# EAGLE design kombee (EAGLE 6.4)
www.komby.com/RF1
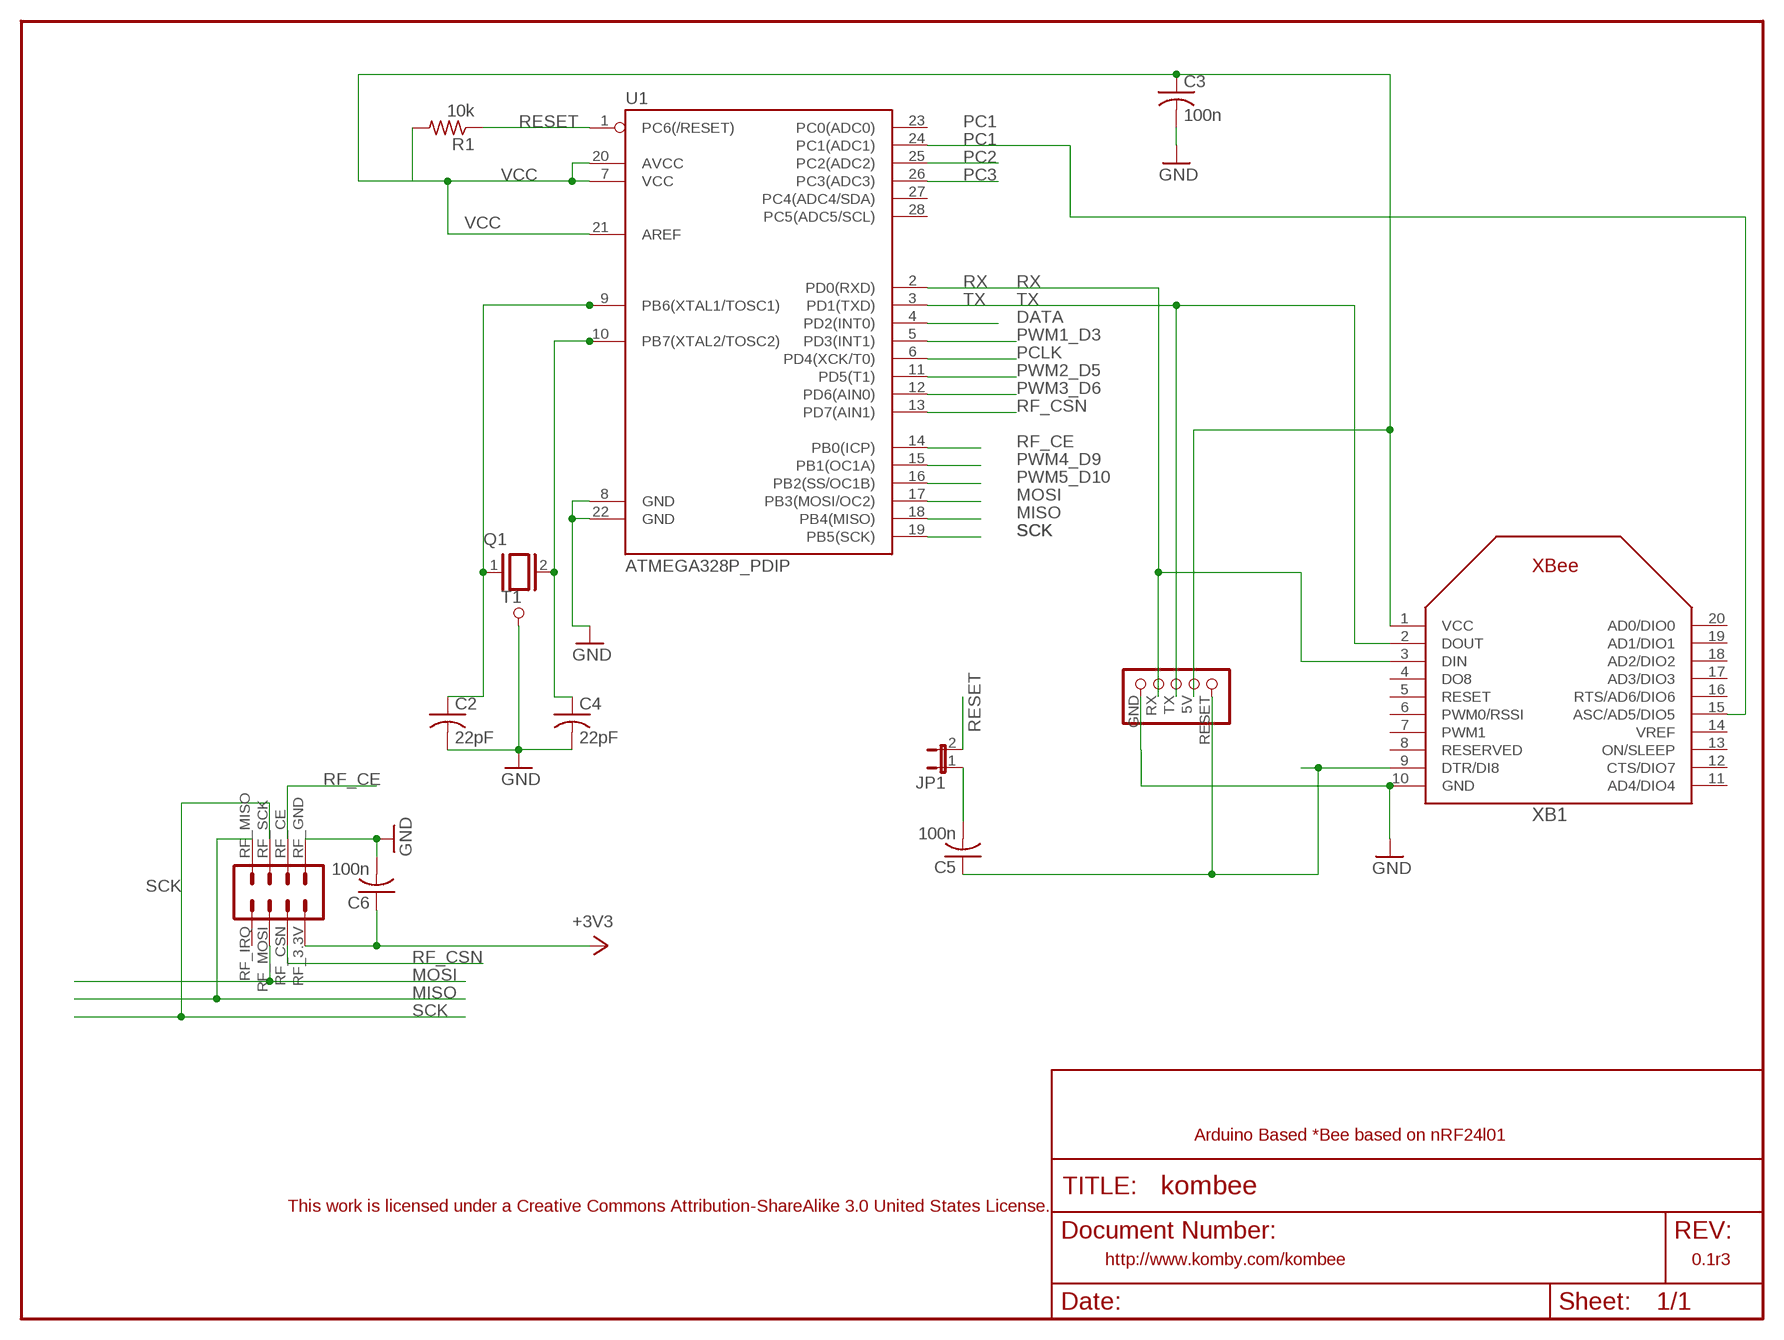
[diagram p0: schematic, sheet 1]

## Parts
C2  22pF  C-USC0805K  [C0805K]
C3  100n  C-US025-025X050  [C025-025X050]
C4  22pF  C-USC0805K  [C0805K]
C5  100n  C-US025-025X050  [C025-025X050]
C6  100n  C-US025-025X050  [C025-025X050]
JP1  JP1E  [JP1]
Q1  XTAL/S  [QS]
R1  10k  R-US_0204/7  [0204/7]
T1  PAD_TERMINAL-1.02MM_ROUND  [CON_PAD_ROUND_1.02MM]
U1  ATMEGA328P_PDIP  [DIL28-3]
U$1  NRF24L01_HEADER  [NRF24L01]
U$2  KOMBY_TTL_SERIAL  [KOMBY_SERIAL_FOOTPRINT]
XB1  XBEE  [XBEE]

## Nets
DATA: U1.4(PD2(INT0))
DTR: C5.1 U$2.RESET XB1.9(DTR/DI8)
GND [vcc]: C2.2 C3.2 C4.2 C6.2 T1.P U1.8(GND) U1.22(GND) U$1.RF_GND(RFGND_1) U$2.GND XB1.10(GND)
MISO: U1.18(PB4(MISO)) U$1.RF_MISO
MOSI: U1.17(PB3(MOSI/OC2)) U$1.RF_MOSI
N$5: C4.1 Q1.2 U1.10(PB7(XTAL2/TOSC2))
N$6: C2.1 Q1.1 U1.9(PB6(XTAL1/TOSC1))
N$7: C5.2 JP1.1
PC1: U1.24(PC1(ADC1)) XB1.15(ASC/AD5/DIO5)
PC2: U1.25(PC2(ADC2))
PC3: U1.26(PC3(ADC3))
PCLK: U1.6(PD4(XCK/T0))
PWM1_D3: U1.5(PD3(INT1))
PWM2_D5: U1.11(PD5(T1))
PWM3_D6: U1.12(PD6(AIN0))
PWM4_D9: U1.15(PB1(OC1A))
PWM5_D10: U1.16(PB2(SS/OC1B))
RESET: JP1.2 R1.1 U1.1(PC6(/RESET))
RF_CE: U1.14(PB0(ICP)) U$1.RF_CE
RF_CSN: U1.13(PD7(AIN1)) U$1.RF_CSN
RX: U1.2(PD0(RXD)) U$2.RX XB1.3(DIN)
SCK: U1.19(PB5(SCK)) U$1.RF_SCK
TX: U1.3(PD1(TXD)) U$2.TX XB1.2(DOUT)
VCC: C3.1 C6.1 R1.2 U1.7(VCC) U1.20(AVCC) U1.21(AREF) U$1.RF_3.3V U$2.5V XB1.1(VCC) ; supply symbol labelled +3V3
Unconnected: U1.23(PC0(ADC0)) U1.27(PC4(ADC4/SDA)) U1.28(PC5(ADC5/SCL)) U$1.RF_IRQ XB1.4(DO8) XB1.5(RESET) XB1.6(PWM0/RSSI) XB1.7(PWM1) XB1.8(RESERVED) XB1.11(AD4/DIO4) XB1.12(CTS/DIO7) XB1.13(ON/SLEEP) XB1.14(VREF) XB1.16(RTS/AD6/DIO6) XB1.17(AD3/DIO3) XB1.18(AD2/DIO2) XB1.19(AD1/DIO1) XB1.20(AD0/DIO0)

## Notes on the sheet
- Arduino Based *Bee based on nRF24l01
- This work is licensed under a Creative Commons Attribution-ShareAlike 3.0 United States License.
- http://www.komby.com/kombee | 0.1r3

## Library data of the parts
C2-C6 = adafruit:C-US: CAPACITOR, American symbol
JP1 = jumper:JP1E: JUMPER
Q1 = special:XTAL/S: CRYSTAL
R1 = adafruit:R-US_: RESISTOR, American symbol
T1 = dp_devices:PAD_TERMINAL: Terminal connection pad
U1 = SparkFun-DigitalIC:ATMEGA328P_PDIP: uC used in the Arduino 32kb flash, 1k EEPROM, 2k SRAM This is the through-hole version of this chip.
U$1 = komby1:NRF24L01_HEADER: Header for the NRF24L01 8 Pin Transceivers. http://www.komby.com
U$2 = komby1:KOMBY_TTL_SERIAL
XB1 = adafruit:XBEE

## Net classes
0 default: width 0.203 mm
1 vcc: width 0.305 mm
2 gnd: width 0.254 mm

## Board
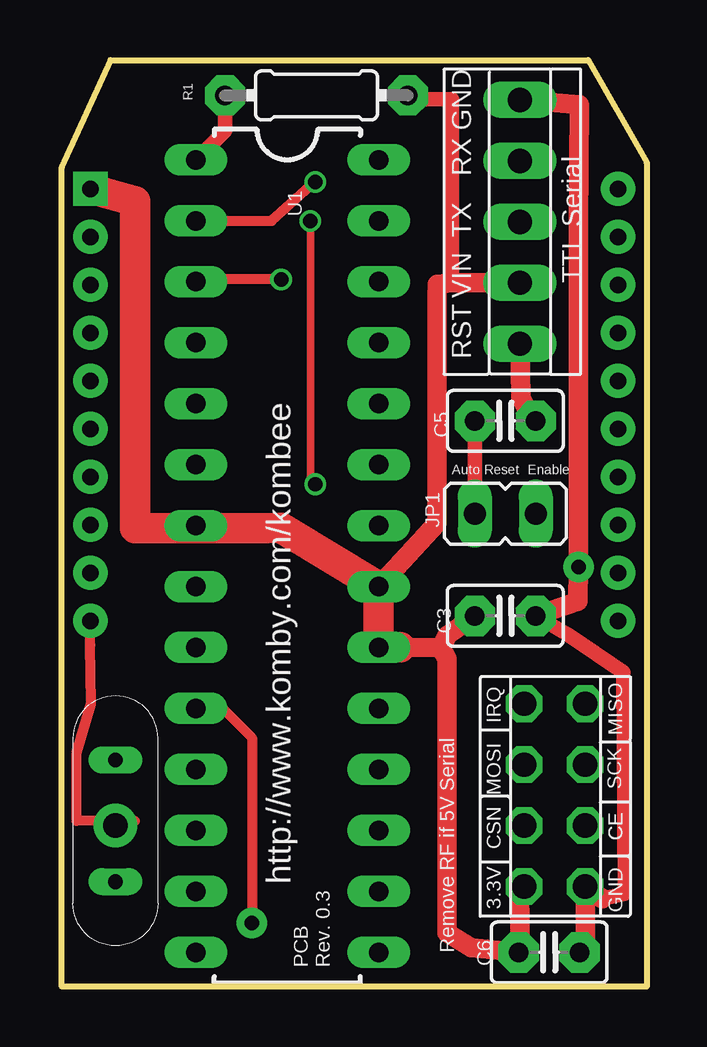
[diagram p1: board, top side]
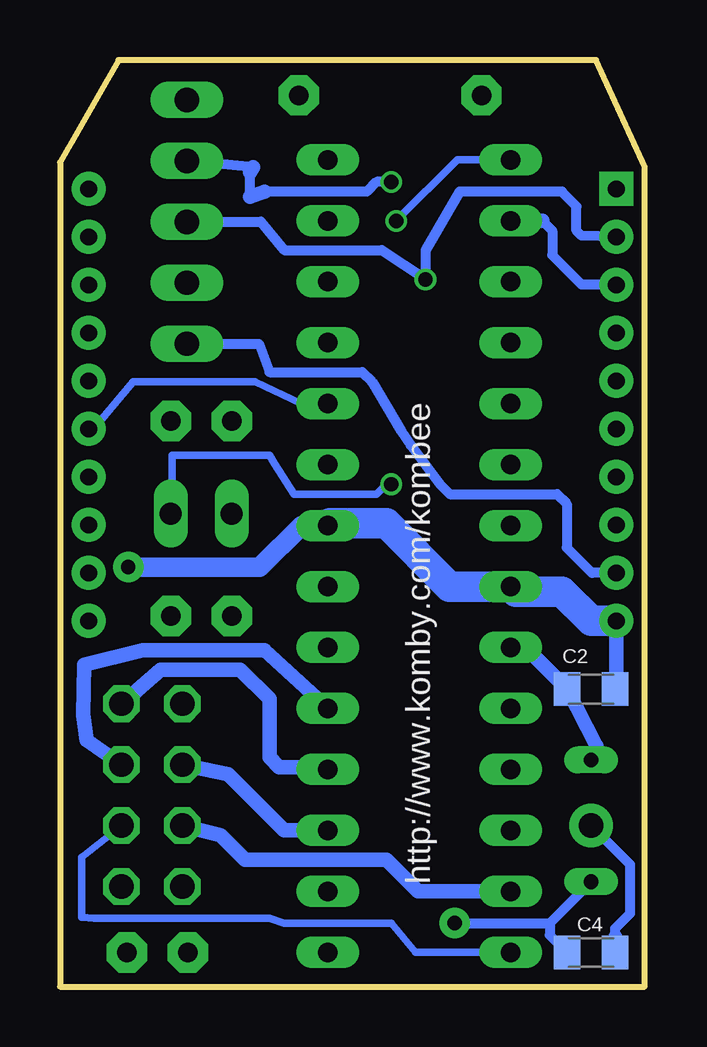
[diagram p2: board, bottom side, seen from below]

Size 24.38 x 38.61 mm. Coordinates in mm from the lower left corner, seen from the top.
Outline: 0,0 0,34.14 2.03,38.61 21.95,38.61 24.38,34.34 24.38,0 0,0
Copper layers (1*16): Top 0.035mm / dielectric 1.5mm / Bottom 0.035mm
Design rules "Fusion_eagle_rule_v1.1": minimum track width 6mil, minimum drill 12mil, track to track 6mil, track to pad 6mil, pad to pad 6mil, via to via 6mil, smd to smd 0mil, copper to edge 10mil, drill to drill 10mil, minimum pad ring 10mil, minimum via ring 6mil, stop-mask expansion 2mil, vias tented up to drill 100mil, thermal gap 10mil

### Footprints (pad centres in the part's own frame; a part is rotated, then mirrored left to right if it is on the bottom)
C0805K = smd 1.1 x 1.4: 1 -1,0; 2 1,0
C025-025X050 = drill 0.813 pad 1.676 octagon: 1 -1.27,0; 2 1.27,0
JP1 = drill 0.914 long: 1 0,-1.27; 2 0,1.27
QS = drill 0.61 long: 1 -2.54,0; 2 2.54,0
0204/7 = drill 0.813 pad 1.676 octagon: 1 -3.81,0; 2 3.81,0
CON_PAD_ROUND_1.02MM = drill 1.02 pad 1.81: P 0,0
DIL28-3 = drill 0.813 long: 1 -16.51,-3.81; 2 -13.97,-3.81; 3 -11.43,-3.81; 4 -8.89,-3.81; 5 -6.35,-3.81; 6 -3.81,-3.81; 7 -1.27,-3.81; 8 1.27,-3.81; 9 3.81,-3.81; 10 6.35,-3.81; 11 8.89,-3.81; 12 11.43,-3.81; 13 13.97,-3.81; 14 16.51,-3.81; 15 16.51,3.81; 16 13.97,3.81; 17 11.43,3.81; 18 8.89,3.81; 19 6.35,3.81; 20 3.81,3.81; 21 1.27,3.81; 22 -1.27,3.81; 23 -3.81,3.81; 24 -6.35,3.81; 25 -8.89,3.81; 26 -11.43,3.81; 27 -13.97,3.81; 28 -16.51,3.81
NRF24L01 = drill 1.016 octagon: RF_3.3V 2.54,-0.635; RF_CE 0,1.905; RF_CSN 0,-0.635; RF_GND 2.54,1.905; RF_IRQ -5.08,-0.635; RF_MISO -5.08,1.905; RF_MOSI -2.54,-0.635; RF_SCK -2.54,1.905
KOMBY_SERIAL_FOOTPRINT = drill 1.016 long: 5V 3.25,3.925; GND 3.25,11.545; RESET 3.25,1.385; RX 3.25,9.005; TX 3.25,6.465
XBEE = drill 0.7 pad 1.422 square: 1 -11,5.5 | drill 0.7 pad 1.422: 2 -11,3.5; 3 -11,1.5; 4 -11,-0.5; 5 -11,-2.5; 6 -11,-4.5; 7 -11,-6.5; 8 -11,-8.5; 9 -11,-10.5; 10 -11,-12.5; 11 11,-12.5; 12 11,-10.5; 13 11,-8.5; 14 11,-6.5; 15 11,-4.5; 16 11,-2.5; 17 11,-0.5; 18 11,1.5; 19 11,3.5; 20 11,5.5

### Placement (x,y rotation side)
C2  2.24,12.4 0 bottom
C3  18.49,15.44 0 top
C4  2.24,1.42 0 bottom
C5  18.49,23.57 180 top
C6  20.32,1.42 0 top
JP1  18.49,19.71 270 top
Q1  2.24,6.91 270 top
R1  10.62,37.13 0 top
T1  2.24,6.71 90 top
U1  9.4,17.94 270 top
U$1  19.91,6.71 270 top
U$2  15.85,25.4 0 top
XB1  12.19,27.74 0 top

### Tracks (layer width: path | path; a pad name or v marks a point on that pad's centre or on a via)
DTR
  Top 0.61: 19.51,23.77 19.3,23.42 C5.1
  Top 0.813: U$2.RESET 19.14,24.55 19.51,23.77
  Bottom 0.406: U$2.RESET 16.09,26.78 15.65,25.6 11.79,25.6 11.38,25.2 10.16,23.16 9.75,22.55 8.53,20.93 8.13,20.52 3.66,20.52 3.25,20.12 3.25,18.29 2.2,17.24 XB1.9
GND  (via drill 0.6 pad 1.27)
  Top 0.406: T1.P 3.05,6.91 0.61,6.91 0.61,9.75 1.22,11.79 1.19,14.22 XB1.10
  Top 0.61: C3.2 21.13,14.63 23.42,13.11 23.47,3.86 22.53,3.66
  Top 0.813: C6.2 21.82,1.72 U$1.RF_GND 22.53,3.66 | U$2.GND 21.58,36.74 21.54,31.7 v21.54,17.47 21.52,16.05 C3.2
  Bottom 0.406: C4.2 1.23,2.42 0.61,3.05 0.61,5.08 T1.P
  Bottom 0.61: C4.2 1.22,2.05 | 1.02,12.19 C2.2 | C2.2 1.19,12.35 | XB1.10 1.19,12.44 C2.2
  Bottom 0.813: U1.22 14.32,19.21 16.05,17.47 v21.54,17.47
  Bottom 1.27: XB1.10 2.23,15.24 3.45,16.46 5.38,16.46 U1.8 8.14,16.67 10.77,19.3 13.12,19.3 U1.22
MISO
  Bottom 0.61: U1.18 13.31,9.14 15.24,9.14 15.65,9.55 15.65,11.99 16.87,13.21 20.19,13.21 U$1.RF_MISO
MOSI
  Bottom 0.61: U1.17 15.04,6.51 17.37,8.84 U$1.RF_MOSI
N$5  (via drill 0.6 pad 1.27)
  Top 0.406: U1.10 6.7,11.59 7.92,10.36 v7.92,2.64
  Bottom 0.406: v7.92,2.64 3.96,2.64 | 3.96,2.64 Q1.2 | 3.96,2.64 3.96,2.15 C4.1
N$6
  Bottom 0.61: Q1.1 2.02,10.04 C2.1 4.97,14.13 U1.9
N$7
  Top 0.61: C5.2 JP1.1
PC1
  Bottom 0.305: XB1.15 23.19,22.99 21.34,25.2 16.26,25.2 14.32,24.29 U1.24
RESET  (via drill 0.6)
  Top 0.305: v10.36,31.9 10.36,21.13 v10.57,20.93
  Top 0.61: R1.1 6.81,35.66 U1.1
  Bottom 0.305: U1.1 7.82,34.45 v10.36,31.9 | v10.57,20.93 10.77,20.93 11.18,20.52 14.63,20.52 15.44,21.79 15.65,22.15 19.71,22.15 19.71,20.32 JP1.2
RF_CE
  Bottom 0.305: U1.14 9.56,1.43 10.57,2.64 15.04,2.64 15.65,2.84 22.96,2.84 23.47,2.9 23.47,5.38 U$1.RF_CE
RF_CSN
  Bottom 0.61: U1.13 9.46,3.97 10.77,5.28 16.66,5.28 17.68,6.3 U$1.RF_CSN
RX  (via drill 0.6)
  Top 0.406: U1.2 8.74,31.91 v10.57,33.53
  Bottom 0.406: 4.27,31.91 3.86,31.5 3.86,30.48 2.64,29.26 1.22,29.26 | v10.57,33.53 11.18,33.53 11.58,33.12 15.85,33.12 | 16.46,32.92 16.46,33.93 | 16.34,34.14 U$2.RX
  Bottom 0.61: U1.2 4.27,31.91 | 1.22,29.26 XB1.3 | 15.85,33.12 16.46,32.92 | 16.46,33.93 16.34,34.14
SCK
  Bottom 0.61: U1.19 15.85,14.02 20.93,14.02 23.37,13.41 23.42,11.33 23.27,10.26 U$1.RF_SCK
TX  (via drill 0.6)
  Top 0.406: v9.14,29.46 5.69,29.46
  Top 0.61: 5.69,29.46 U1.3
  Bottom 0.406: U$2.TX 16.02,31.87 15.04,30.68 10.97,30.68 v9.14,29.46 9.14,30.68 7.72,33.12 3.45,33.12 2.84,32.51 2.84,31.5 2.64,31.29 XB1.2
VCC
  Top 0.61: 14.43,36.78 R1.2 14.83,36.98 16.26,36.98 16.26,29.32
  Top 0.813: C3.1 16.07,14.63 15.8,14.12 | 15.8,14.12 14.11,14.13 | 15.8,14.12 16.05,13.66 16.05,2.23 17.07,1.63 C6.1 19.1,1.84 19.1,3.05 19.08,3.48 U$1.RF_3.3V | U$2.5V 16.26,29.32 15.66,29.27 15.65,28.72 15.65,19.31 U1.21
  Top 1.27: 5.7,19.1 6.1,19.1 8.53,19.1 9.14,19.11 U1.21 U1.20 14.11,14.13 | 5.7,19.1 U1.7 5.48,19.1 | XB1.1 3.05,32.71 3.05,19.1 5.7,19.1

### Text on the board
tNames: Auto Reset Enable | http://www.komby.com/kombee | Remove RF if 5V Serial | PCB / Rev. 0.3
bNames: http://www.komby.com/kombee